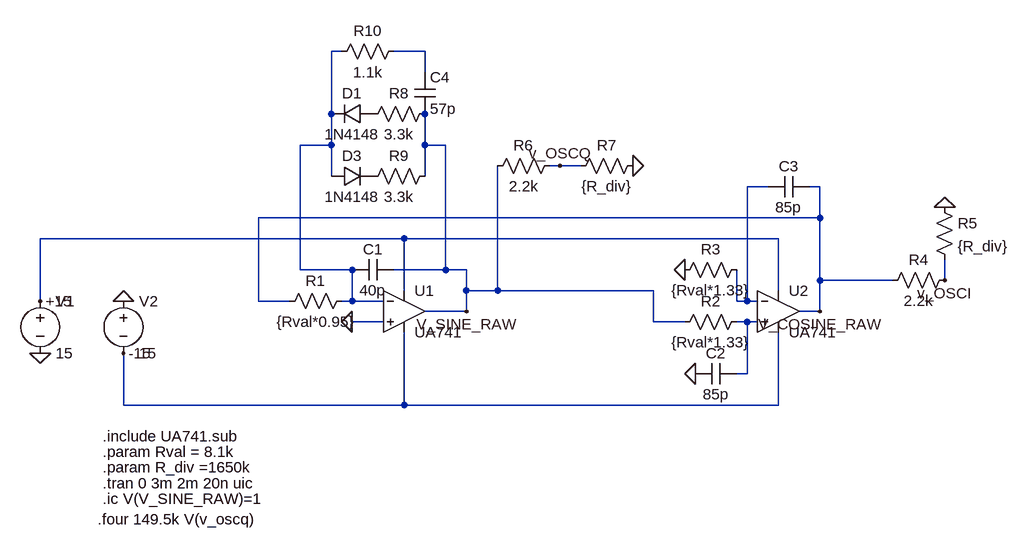
[diagram p0: schematic Oscillator.asc]
Oscillator.asc, the LTspice schematic file:
Version 4
SHEET 1 880 720
WIRE -2192 -16 -2208 -16
WIRE -2064 -16 -2112 -16
WIRE -2064 16 -2064 -16
WIRE -2208 80 -2208 -16
WIRE -2208 128 -2208 80
WIRE -2208 128 -2256 128
WIRE -2064 128 -2064 80
WIRE -2032 128 -2064 128
WIRE -1856 160 -1872 160
WIRE -1824 160 -1856 160
WIRE -2208 176 -2208 128
WIRE -2064 176 -2064 128
WIRE -1536 192 -1568 192
WIRE -1456 192 -1472 192
WIRE -1456 240 -1456 192
WIRE -1456 240 -2320 240
WIRE -2096 272 -2656 272
WIRE -1520 272 -2096 272
WIRE -2256 320 -2256 128
WIRE -2176 320 -2256 320
WIRE -2032 320 -2032 128
WIRE -2032 320 -2112 320
WIRE -2000 320 -2032 320
WIRE -1456 336 -1456 240
WIRE -1344 336 -1456 336
WIRE -1264 336 -1264 304
WIRE -2096 352 -2096 272
WIRE -2000 352 -2000 320
WIRE -1952 352 -1952 160
WIRE -1952 352 -2000 352
WIRE -1712 352 -1952 352
WIRE -1520 352 -1520 272
WIRE -2656 368 -2656 272
WIRE -2320 368 -2320 240
WIRE -2272 368 -2320 368
WIRE -2176 368 -2176 320
WIRE -2176 368 -2192 368
WIRE -2128 368 -2176 368
WIRE -1584 368 -1584 320
WIRE -1568 368 -1568 192
WIRE -1568 368 -1584 368
WIRE -1552 368 -1568 368
WIRE -2000 384 -2000 352
WIRE -2000 384 -2064 384
WIRE -1456 384 -1456 336
WIRE -1456 384 -1488 384
WIRE -2128 400 -2176 400
WIRE -1712 400 -1712 352
WIRE -1664 400 -1712 400
WIRE -1568 400 -1584 400
WIRE -1552 400 -1568 400
WIRE -1568 480 -1568 400
WIRE -1568 480 -1584 480
WIRE -2528 528 -2528 448
WIRE -2096 528 -2096 416
WIRE -2096 528 -2528 528
WIRE -1520 528 -1520 416
WIRE -1520 528 -2096 528
FLAG -2656 448 0
FLAG -2528 368 0
FLAG -2656 368 +15
FLAG -2528 448 -15
FLAG -2176 400 0
FLAG -2000 384 V_SINE_RAW
FLAG -1648 480 0
FLAG -1664 320 0
FLAG -1456 384 V_COSINE_RAW
FLAG -1264 224 0
FLAG -1264 336 v_OSCI
FLAG -1744 160 0
FLAG -1856 160 v_OSCQ
SYMBOL voltage -2656 352 R0
WINDOW 123 0 0 Left 0
WINDOW 39 0 0 Left 0
SYMATTR InstName V1
SYMATTR Value 15
SYMBOL voltage -2528 352 R0
WINDOW 123 0 0 Left 0
WINDOW 39 0 0 Left 0
SYMATTR InstName V2
SYMATTR Value 15
SYMBOL opamp2 -2096 320 R0
SYMATTR InstName U1
SYMATTR Value UA741
SYMBOL opamp2 -1520 320 R0
SYMATTR InstName U2
SYMATTR Value UA741
SYMBOL res -2176 352 R90
WINDOW 0 0 56 VBottom 2
WINDOW 3 32 56 VTop 2
SYMATTR InstName R1
SYMATTR Value {Rval*0.95}
SYMBOL cap -2112 304 R90
WINDOW 0 0 32 VBottom 2
WINDOW 3 32 32 VTop 2
SYMATTR InstName C1
SYMATTR Value 40p
SYMBOL res -1568 384 R90
WINDOW 0 0 56 VBottom 2
WINDOW 3 32 56 VTop 2
SYMATTR InstName R2
SYMATTR Value {Rval*1.33}
SYMBOL cap -1584 464 R90
WINDOW 0 0 32 VBottom 2
WINDOW 3 32 32 VTop 2
SYMATTR InstName C2
SYMATTR Value 85p
SYMBOL res -1568 304 R90
WINDOW 0 0 56 VBottom 2
WINDOW 3 32 56 VTop 2
SYMATTR InstName R3
SYMATTR Value {Rval*1.33}
SYMBOL cap -1472 176 R90
WINDOW 0 0 32 VBottom 2
WINDOW 3 32 32 VTop 2
SYMATTR InstName C3
SYMATTR Value 85p
SYMBOL res -1248 320 R90
WINDOW 0 0 56 VBottom 2
WINDOW 3 32 56 VTop 2
SYMATTR InstName R4
SYMATTR Value 2.2k
SYMBOL res -1280 208 R0
SYMATTR InstName R5
SYMATTR Value {R_div}
SYMBOL res -1856 144 R90
WINDOW 0 0 56 VBottom 2
WINDOW 3 32 56 VTop 2
SYMATTR InstName R6
SYMATTR Value 2.2k
SYMBOL res -1728 144 R90
WINDOW 0 0 56 VBottom 2
WINDOW 3 32 56 VTop 2
SYMATTR InstName R7
SYMATTR Value {R_div}
SYMBOL diode -2144 64 R90
WINDOW 0 0 32 VBottom 2
WINDOW 3 32 32 VTop 2
SYMATTR InstName D1
SYMATTR Value 1N4148
SYMBOL diode -2208 192 R270
WINDOW 0 32 32 VTop 2
WINDOW 3 0 32 VBottom 2
SYMATTR InstName D3
SYMATTR Value 1N4148
SYMBOL res -2048 64 R90
WINDOW 0 0 56 VBottom 2
WINDOW 3 32 56 VTop 2
SYMATTR InstName R8
SYMATTR Value 3.3k
SYMBOL res -2048 160 R90
WINDOW 0 0 56 VBottom 2
WINDOW 3 32 56 VTop 2
SYMATTR InstName R9
SYMATTR Value 3.3k
SYMBOL res -2096 -32 R90
WINDOW 0 0 56 VBottom 2
WINDOW 3 32 56 VTop 2
SYMATTR InstName R10
SYMATTR Value 1.1k
SYMBOL cap -2080 16 R0
SYMATTR InstName C4
SYMATTR Value 57p
TEXT -2560 576 Left 2 !.include UA741.sub
TEXT -2560 600 Left 2 !.param Rval = 8.1k
TEXT -2560 624 Left 2 !.param R_div =1650k
TEXT -2560 648 Left 2 !.tran 0 3m 2m 20n uic
TEXT -2560 672 Left 2 !.ic V(V_SINE_RAW)=1
TEXT -2568 704 Left 2 !.four 149.5k V(v_oscq)

The netlist it stands for:
* Oscillator.asc
V1 +15 0 15
V2 0 -15 15
XU1 0 N001 +15 -15 V_SINE_RAW UA741  ; pins In+ In- V+ V- OUT
XU2 N004 N003 +15 -15 V_COSINE_RAW UA741  ; pins In+ In- V+ V- OUT
R1 N001 V_COSINE_RAW {Rval*0.95}
C1 V_SINE_RAW N001 40p
R2 N004 V_SINE_RAW {Rval*1.33}
C2 N004 0 85p
R3 N003 0 {Rval*1.33}
C3 V_COSINE_RAW N003 85p
R4 v_OSCI V_COSINE_RAW 2.2k
R5 0 v_OSCI {R_div}
R6 v_OSCQ V_SINE_RAW 2.2k
R7 0 v_OSCQ {R_div}
D1 P001 N001 1N4148
D3 N001 P002 1N4148
R8 V_SINE_RAW P001 3.3k
R9 V_SINE_RAW P002 3.3k
R10 N002 N001 1.1k
C4 N002 V_SINE_RAW 57p
.model D D
.lib standard.dio
.include UA741.sub
.param Rval = 8.1k
.param R_div =1650k
.tran 0 3m 2m 20n uic
.ic V(V_SINE_RAW)=1
.four 149.5k V(v_oscq)
.backanno
.end